# EAGLE design Camera (EAGLE 7.5.0)
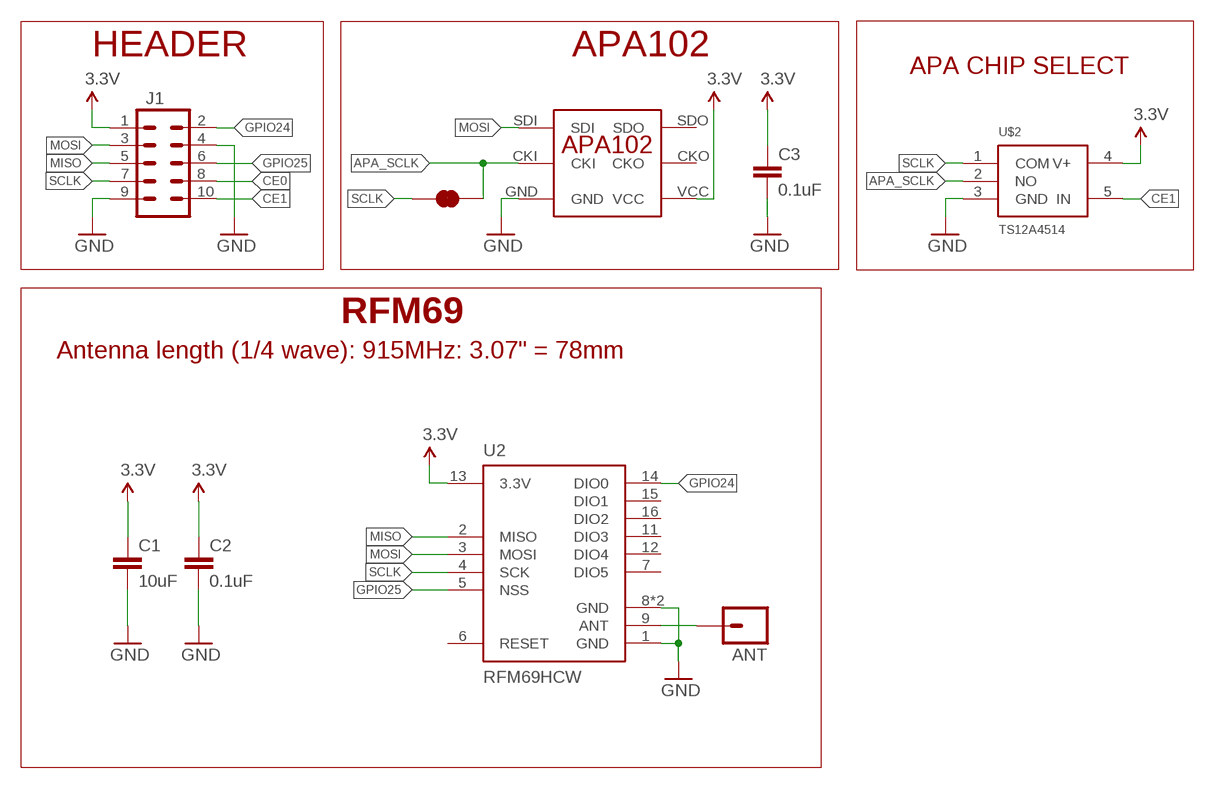
[diagram p0: schematic, sheet 1]

## Parts
ANT  M01PTH_NO_SILK_YES_STOP  [1X01_NO_SILK]
C1  10uF  10UF50V20%(1210)  [1210]
C2  0.1uF  0.1UF-25V(+80/-20%)(0603)  [0603-CAP@1]
C3  0.1uF  0.1UF-25V(+80/-20%)(0603)  [0603-CAP@1]
J1  M05X2NO_SILK  [2X5_NOSILK]
JP1  JUMPER-PAD-2-NC_BY_TRACE  [PAD-JUMPER-2-NC_BY_TRACE_YES_SILK]
U2  RFM69HCW  [RFM69HCW-XXXS2]
U$1  APA102  [APA102]
U$2  TS12A4514  [SOT-23]

## Nets
3.3V: C1.1 C2.1 C3.1 J1.1 U2.13(3.3V) U$1.VCC U$2.4(V+)
ANT: ANT.1 U2.9(ANT)
APA_SCLK: JP1.2 U$1.CKI U$2.2(NO)
CE0: J1.8
CE1: J1.10 U$2.5(IN)
GND: C1.2 C2.2 C3.2 J1.4 J1.9 U2.1(GND) U2.8(GND) U2.10(GND) U$1.GND U$2.3(GND)
GPIO24: J1.2 U2.14(DIO0)
GPIO25: J1.6 U2.5(NSS)
MISO: J1.5 U2.2(MISO)
MOSI: J1.3 U2.3(MOSI) U$1.SDI
SCLK: J1.7 JP1.1 U2.4(SCK) U$2.1(COM)
Unconnected: U2.6(RESET) U2.7(DIO5) U2.11(DIO3) U2.12(DIO4) U2.15(DIO1) U2.16(DIO2) U$1.CKO U$1.SDO

## Notes on the sheet
- HEADER | APA102
- APA CHIP SELECT
- RFM69
- Antenna length (1/4 wave): 915MHz: 3.07" = 78mm

## Library data of the parts
ANT = SparkFun-Connectors:M01: Header 1 Standard 1-pin 0.1" header. Use with straight break away headers (SKU : PRT-00116), right angle break away headers (PRT-00553), swiss pins (PRT-00743), machine pins (PRT-00117), and female headers (PRT-00115). SMTSO-256-ET is a "flush mount" nut for a 4-40 screw. The older package used to be too tight, and did not allow it to sit properly thru the drill hit. The latest (0.165DIA) fits nice and snug.
C1 = SparkFun-Capacitors:10UF50V20%(1210): CAP-09824; PROD_ID: CAP-09824
C2 C3 = SparkFun-Capacitors:0.1UF-25V(+80/-20%)(0603): CAP-00810 Ceramic Standard decoupling cap; PROD_ID: CAP-00810
J1 = SparkFun-Connectors:M05X2: Header 5x2 Standard 10-pin dual row 0.1" header. Commonly used with AVR-ISP. Use with Spark Fun Electronics SKU: PRT-00778
JP1 = SparkFun-Passives:JUMPER-PAD-2-NC_BY_TRACE
U2 = mike-temp:RFM69H
U$1 = SAUVE:APA102
U$2 = SAUVE:TS12A4514

## Board
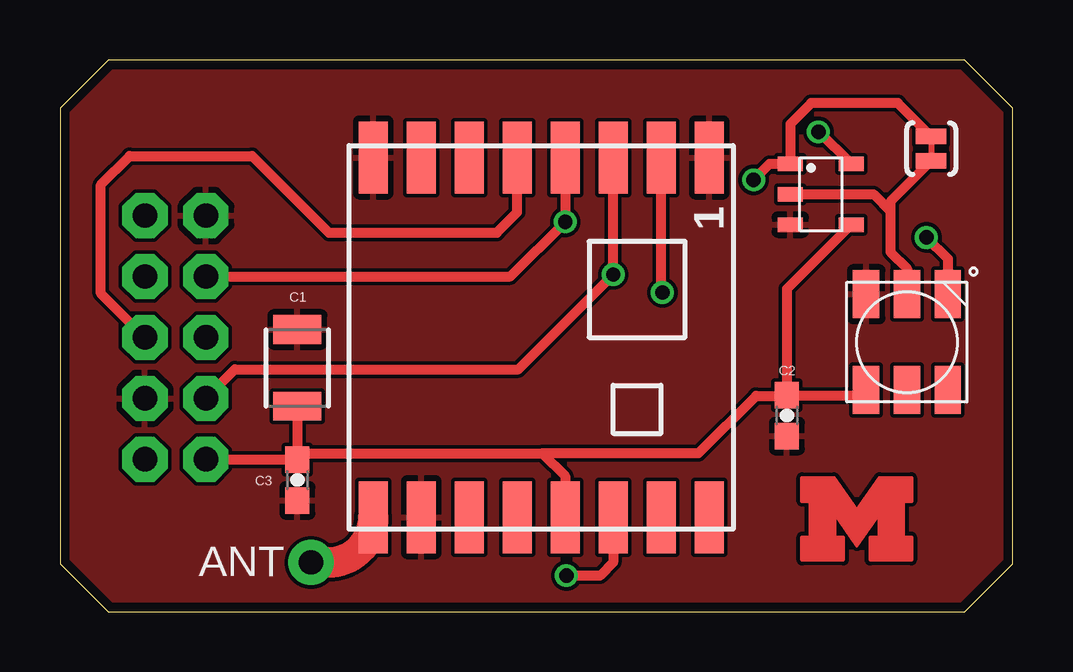
[diagram p1: board, top side]
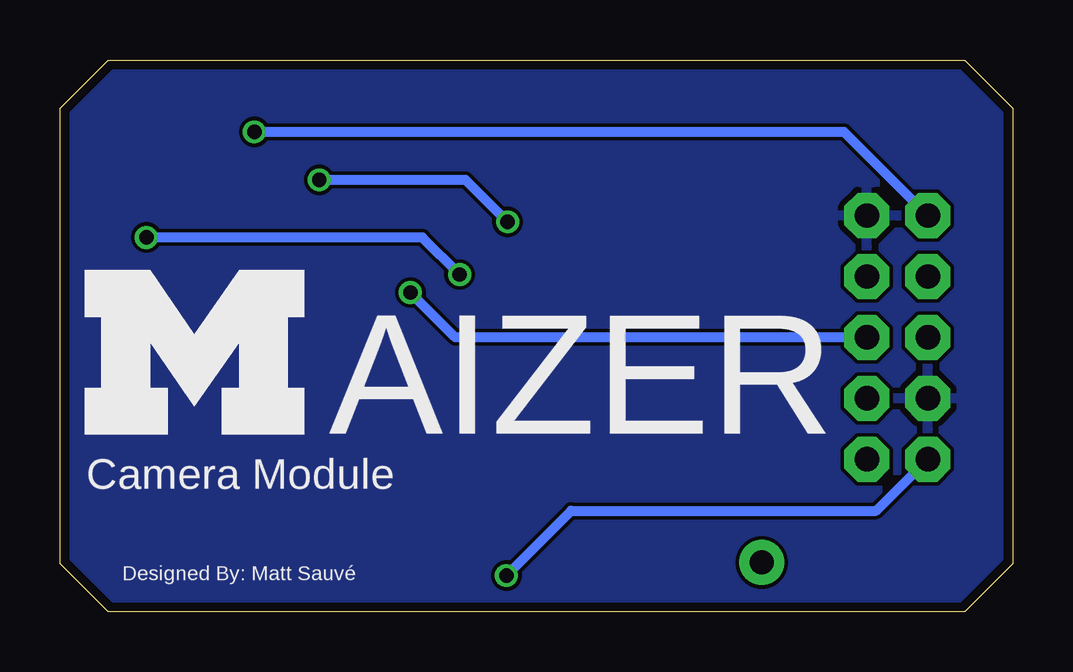
[diagram p2: board, bottom side, seen from below]

Size 39.7 x 23 mm. Coordinates in mm from the lower left corner, seen from the top.
Outline: 2,0 37.7,0 39.7,2 39.7,21 37.7,23 2,23 0,21 0,2 2,0
Copper layers (1*16): Top 0.0356mm / dielectric 1.5011mm / Bottom 0.0356mm
Design rules "oshpark-2layer": minimum track width 6mil, minimum drill 13mil, track to track 6mil, track to pad 6mil, pad to pad 6mil, via to via 6mil, smd to smd 6mil, copper to edge 15mil, drill to drill 6mil, minimum pad ring 7mil, minimum via ring 7mil, stop-mask expansion 2.5mil, vias tented up to drill 0mil, thermal gap 10mil

### Footprints (pad centres in the part's own frame; a part is rotated, then mirrored left to right if it is on the bottom)
1X01_NO_SILK = drill 1.016 pad 1.88: 1 0,0
1210 = smd 1.2 x 2: 1 -1.6,0; 2 1.6,0
0603-CAP@1 = smd 1.1 x 1: 1 -0.85,0; 2 0.85,0
2X5_NOSILK = drill 1.016 pad 1.88 octagon: 1 -1.27,5.08; 2 1.27,5.08; 3 -1.27,2.54; 4 1.27,2.54; 5 -1.27,0; 6 1.27,0; 7 -1.27,-2.54; 8 1.27,-2.54; 9 -1.27,-5.08; 10 1.27,-5.08
PAD-JUMPER-2-NC_BY_TRACE_YES_SILK = smd 0.635 x 1.27: 1 -0.508,0; 2 0.508,0
RFM69HCW-XXXS2 = smd 3 x 1.2: 1 -7.5,7; 2 -7.5,5; 3 -7.5,3; 4 -7.5,1; 5 -7.5,-1; 6 -7.5,-3; 7 -7.5,-5; 8 -7.5,-7; 9 7.5,-7; 10 7.5,-5; 11 7.5,-3; 12 7.5,-1; 13 7.5,1; 14 7.5,3; 15 7.5,5; 16 7.5,7
APA102 = smd 2 x 1.1: CKI -2,0; CKO 2,0; GND -2,-1.7; SDI -2,1.7; SDO 2,1.7; VCC 2,-1.7
SOT-23 = smd 0.6 x 1.05: 1 -1.27,-1.27; 2 0,-1.27; 3 1.27,-1.27; 4 1.27,1.27; 5 -1.27,1.27

### Placement (x,y rotation side)
ANT  10.46,2.05 90 top
C1  9.89,10.16 90 top
C2  30.29,8.17 270 top
C3  9.89,5.48 270 top
J1  4.81,11.43 180 top
JP1  36.3,19.3 270 top
U2  20.05,11.43 270 top
U$1  35.29,11.23 270 top
U$2  31.7,17.4 270 top
U$3  [BLOCK-M-5MM-MASK]  33.2,3.8 0 top
U$5  [BLOCK-M-10MM]  34.1,10.7 0 bottom

### Tracks (layer width: path | path; a pad name or v marks a point on that pad's centre or on a via)
3.3V
  Top 0.406: C1.1 C3.1 | J1.1 9.87,6.35 C3.1 | 21,3.98 U2.13 21.05,5.65 20.1,6.6 | C3.1 10.2,6.6 20.1,6.6 | 20.1,6.6 26.6,6.6 29,9 30.27,9 C2.1 | C2.1 33.38,9.02 U$1.VCC | U$2.4 30.29,13.45 C2.1
ANT
  Top 1.27: ANT.1 11.17,2.05 arc90 U2.9
APA_SCLK
  Top 0.406: U$2.2 33.9,17.4 34.6,16.7 | 34.6,16.7 34.6,15 35.3,14.3 U$1.CKI | JP1.2 34.6,17.09 34.6,16.7
CE1  (via drill 0.6)
  Top 0.406: U$2.5 31.64,20 v31.6,20
  Bottom 0.406: J1.10 7.03,20 v31.6,20
GND
  pour Top: 0,2 0,21 2,23 37.7,23 39.7,21 39.7,2 37.7,0 2,0
  pour Bottom: 0,21 2,23 37.7,23 39.7,21 39.7,2 37.7,0 2,0 0,2
GPIO24  (via drill 0.6)
  Top 0.406: U2.14 23.05,2.05 22.5,1.5 v21.1,1.5
  Bottom 0.406: v21.1,1.5 18.4,4.2 5.69,4.2 J1.2
GPIO25
  Top 0.406: J1.6 1.7,13.27 1.7,17.8 2.9,19 8,19 11.2,15.8 18.2,15.8 19.05,16.65 U2.5
MISO  (via drill 0.6)
  Top 0.406: v25.1,13.3 25.05,13.35 U2.2
  Bottom 0.406: J1.5 23.23,11.43 v25.1,13.3
MOSI  (via drill 0.6)
  Top 0.406: J1.3 7.29,10.1 19.1,10.1 v23.05,14.05 U2.3 | v36.1,15.6 36.99,14.71 U$1.SDI
  Bottom 0.406: v23.05,14.05 24.6,15.6 v36.1,15.6
SCLK  (via drill 0.6)
  Top 0.406: J1.7 18.77,13.97 v21.05,16.25 U2.4 | v28.9,18 29.57,18.67 U$2.1 30.43,20.33 31.3,21.2 34.91,21.2 JP1.1
  Bottom 0.406: v21.05,16.25 22.8,18 v28.9,18

### Text on the board
bPlace: AIZER | Camera Module | Designed By: Matt Sauvé